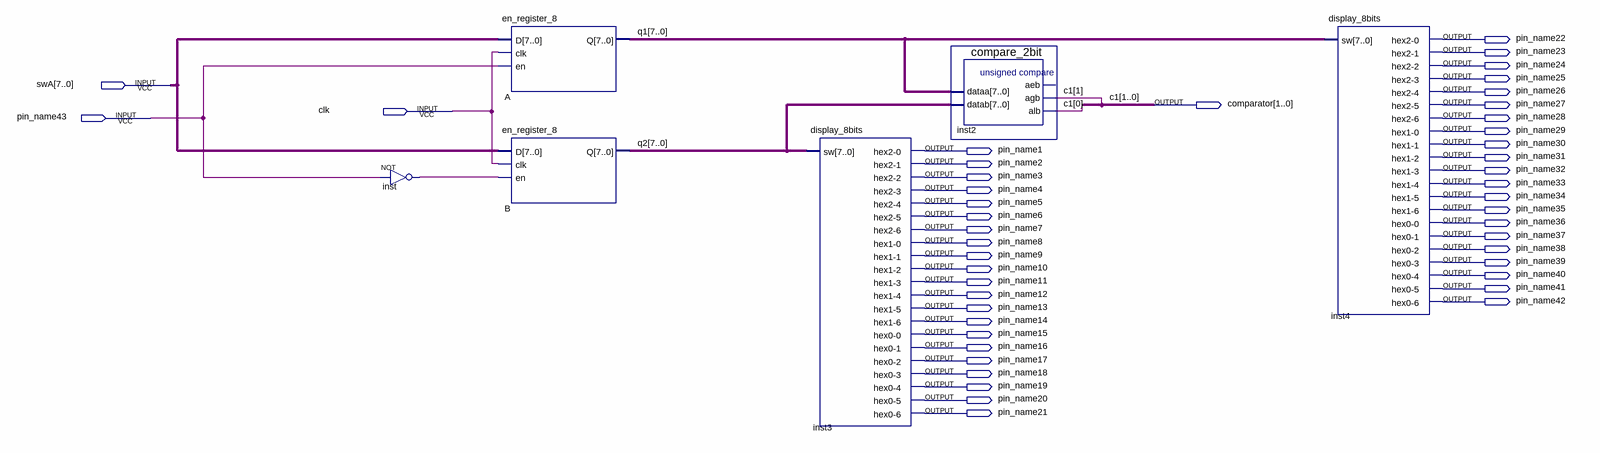
[diagram p0: schematic sheet]
// Quartus schematic seq_comparator.bdf as structural Verilog: 6 symbols, 46 pins
module seq_comparator (
  input  [7:0] swA,
  input  clk,
  input  pin_name43,
  output pin_name22,
  output pin_name23,
  output pin_name24,
  output pin_name25,
  output pin_name26,
  output [1:0] comparator,
  output pin_name27,
  output pin_name28,
  output pin_name29,
  output pin_name30,
  output pin_name1,
  output pin_name31,
  output pin_name2,
  output pin_name32,
  output pin_name3,
  output pin_name33,
  output pin_name4,
  output pin_name34,
  output pin_name5,
  output pin_name35,
  output pin_name6,
  output pin_name36,
  output pin_name7,
  output pin_name37,
  output pin_name8,
  output pin_name38,
  output pin_name9,
  output pin_name39,
  output pin_name10,
  output pin_name40,
  output pin_name11,
  output pin_name41,
  output pin_name12,
  output pin_name42,
  output pin_name13,
  output pin_name14,
  output pin_name15,
  output pin_name16,
  output pin_name17,
  output pin_name18,
  output pin_name19,
  output pin_name20,
  output pin_name21
);

  wire inst_out;
  wire [7:0] q1, q2;

  not inst (inst_out, pin_name43);
  en_register_8 A (.D(swA), .clk(clk), .en(pin_name43), .Q(q1));
  en_register_8 B (.D(swA), .clk(clk), .en(inst_out), .Q(q2));
  display_8bits inst3 (
    .sw(q2), .\hex2-0 (pin_name1), .\hex2-1 (pin_name2), .\hex2-2 (pin_name3), .\hex2-3 (pin_name4),
    .\hex2-4 (pin_name5), .\hex2-5 (pin_name6), .\hex2-6 (pin_name7), .\hex1-0 (pin_name8),
    .\hex1-1 (pin_name9), .\hex1-2 (pin_name10), .\hex1-3 (pin_name11), .\hex1-4 (pin_name12),
    .\hex1-5 (pin_name13), .\hex1-6 (pin_name14), .\hex0-0 (pin_name15), .\hex0-1 (pin_name16),
    .\hex0-2 (pin_name17), .\hex0-3 (pin_name18), .\hex0-4 (pin_name19), .\hex0-5 (pin_name20),
    .\hex0-6 (pin_name21));
  compare_2bit inst2 (.dataa(q1), .datab(q2), .agb(comparator[1]), .alb(comparator[0]));  // open: aeb
  display_8bits inst4 (
    .sw(q1), .\hex2-0 (pin_name22), .\hex2-1 (pin_name23), .\hex2-2 (pin_name24), .\hex2-3 (pin_name25),
    .\hex2-4 (pin_name26), .\hex2-5 (pin_name27), .\hex2-6 (pin_name28), .\hex1-0 (pin_name29),
    .\hex1-1 (pin_name30), .\hex1-2 (pin_name31), .\hex1-3 (pin_name32), .\hex1-4 (pin_name33),
    .\hex1-5 (pin_name34), .\hex1-6 (pin_name35), .\hex0-0 (pin_name36), .\hex0-1 (pin_name37),
    .\hex0-2 (pin_name38), .\hex0-3 (pin_name39), .\hex0-4 (pin_name40), .\hex0-5 (pin_name41),
    .\hex0-6 (pin_name42));

  // Other names for the same wires on the sheet: c1[1:0] = comparator
endmodule
